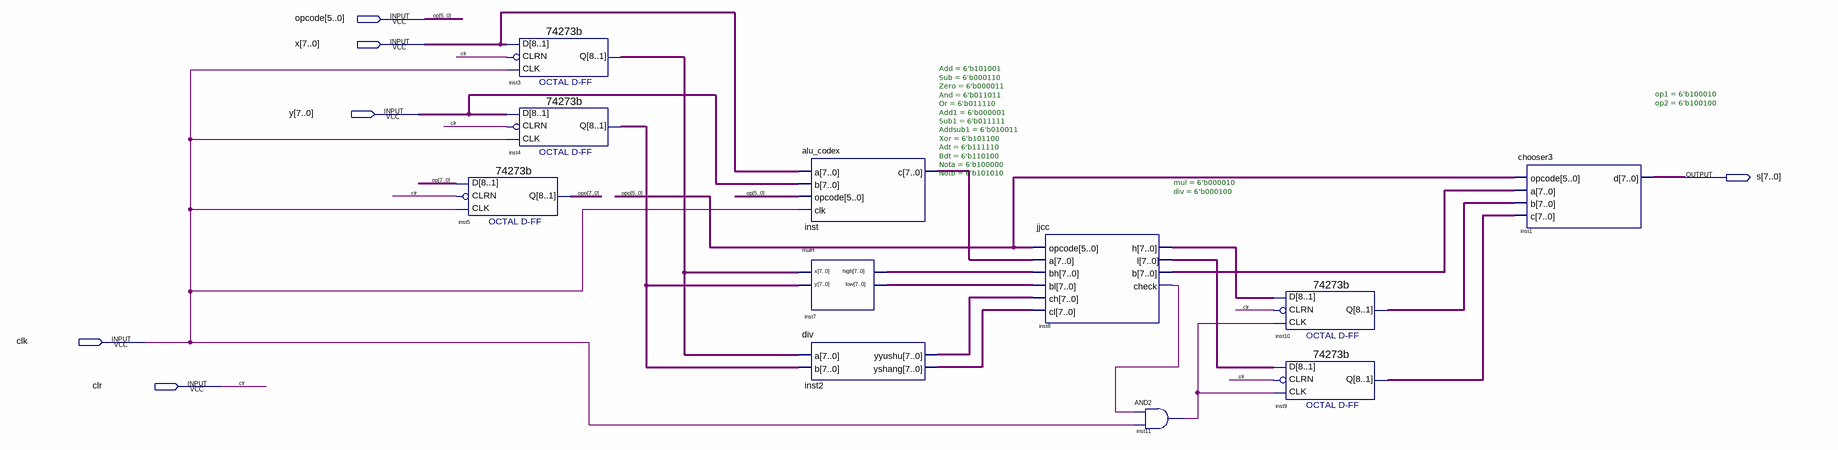
[diagram p0: schematic sheet]
// Quartus schematic cyalu.bdf as structural Verilog: 11 symbols, 6 pins
module cyalu (
  input  [5:0] opcode,
  input  [7:0] x,
  input  [7:0] y,
  input  clk,
  input  clr,
  output [7:0] s
);

  wire inst8_check, inst11_out;
  wire [7:0] inst2_yshang, inst2_yyushu, inst3_q, inst4_q, inst7_high, inst7_low, inst8_b, inst8_h, inst8_l,
       inst9_q, inst10_q, inst_c, opo;
  wire [7:6] op;

  \74273b  inst5 (.CLK(clk), .D({op, opcode}), .CLRN(clr), .Q(opo));
  \74273b  inst3 (.CLK(clk), .D(x), .CLRN(clr), .Q(inst3_q));
  \74273b  inst4 (.CLK(clk), .D(y), .CLRN(clr), .Q(inst4_q));
  alu_codex #(.Add(6'b101001), .Sub(6'b000110), .Zero(6'b000011), .And(6'b011011), .Or(6'b011110), .Add1(6'b000001), .Sub1(6'b011111), .Addsub1(6'b010011), .Xor(6'b101100), .Adt(6'b111110), .Bdt(6'b110100), .Nota(6'b100000), .Notb(6'b101010)) inst (
    .a(x), .b(y), .opcode(opcode), .clk(clk), .c(inst_c));
  mulH inst7 (.x(inst3_q), .y(inst4_q), .high(inst7_high), .low(inst7_low));
  div inst2 (.a(inst3_q), .b(inst4_q), .yyushu(inst2_yyushu), .yshang(inst2_yshang));
  jjcc #(.mul(6'b000010), .div(6'b000100)) inst8 (
    .opcode(opo[5:0]), .a(inst_c), .bh(inst7_high), .bl(inst7_low), .ch(inst2_yyushu), .cl(inst2_yshang),
    .h(inst8_h), .l(inst8_l), .b(inst8_b), .check(inst8_check));
  and inst11 (inst11_out, inst8_check, clk);
  \74273b  inst10 (.CLK(inst11_out), .D(inst8_h), .CLRN(clr), .Q(inst10_q));
  \74273b  inst9 (.CLK(inst11_out), .D(inst8_l), .CLRN(clr), .Q(inst9_q));
  chooser3 #(.op1(6'b100010), .op2(6'b100100)) inst1 (.opcode(opo[5:0]), .a(inst8_b), .b(inst10_q), .c(inst9_q), .d(s));

  // Other names for the same wires on the sheet: op[5:0] = opcode
endmodule
